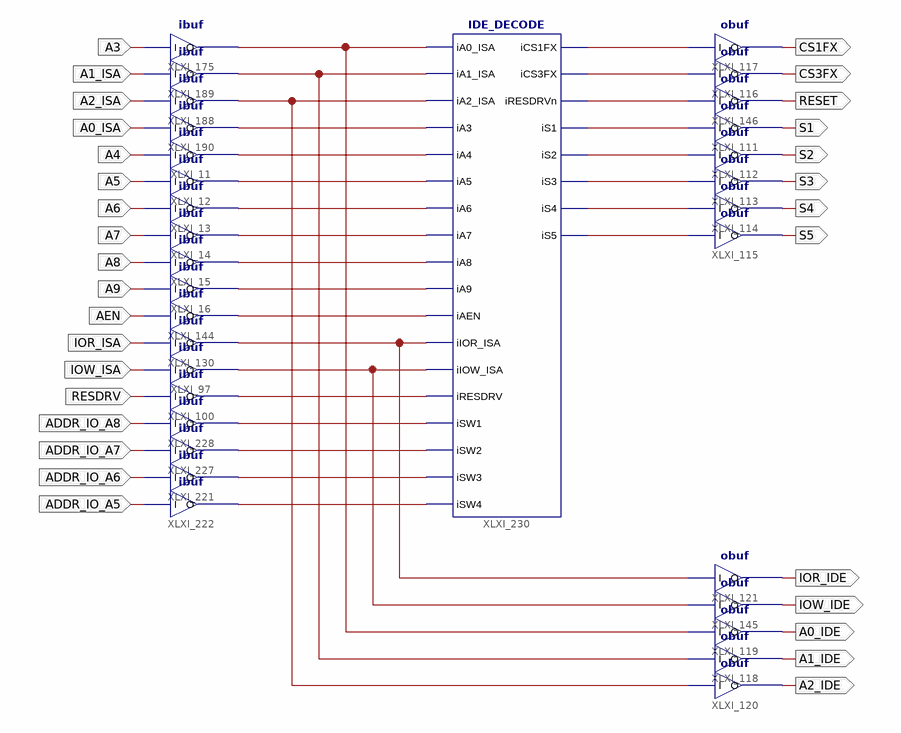
[diagram p0: schematic sheet 1]
// Xilinx ISE schematic Top.sch (xc9500xl) as structural Verilog: 32 symbols, 31 ports
module Top (
  input  RESDRV,
  input  IOW_ISA,
  input  IOR_ISA,
  input  AEN,
  input  A4,
  input  A5,
  input  A6,
  input  A7,
  input  A8,
  input  A9,
  input  A1_ISA,
  input  A2_ISA,
  input  ADDR_IO_A8,
  input  ADDR_IO_A7,
  input  ADDR_IO_A6,
  input  ADDR_IO_A5,
  input  A3,
  input  A0_ISA,
  output A1_IDE,
  output A0_IDE,
  output A2_IDE,
  output IOR_IDE,
  output IOW_IDE,
  output S1,
  output S2,
  output S3,
  output S4,
  output S5,
  output CS3FX,
  output CS1FX,
  output RESET
);

  wire iA0_ISA, iA1_ISA, iA2_ISA, iA3, iA4, iA5, iA6, iA7, iA8, iA9, iAEN, iCS1FX, iCS3FX, iIOR_ISA,
       iIOW_ISA, iRESDRV, iRESDRVn, iS1, iS2, iS3, iS4, iS5, iSW1, iSW2, iSW3, iSW4;

  ibuf XLXI_189 (.I(A1_ISA), .O(iA1_ISA));
  ibuf XLXI_188 (.I(A2_ISA), .O(iA2_ISA));
  ibuf XLXI_11 (.I(A4), .O(iA4));
  ibuf XLXI_144 (.I(AEN), .O(iAEN));
  ibuf XLXI_100 (.I(RESDRV), .O(iRESDRV));
  ibuf XLXI_97 (.I(IOW_ISA), .O(iIOW_ISA));
  ibuf XLXI_130 (.I(IOR_ISA), .O(iIOR_ISA));
  ibuf XLXI_12 (.I(A5), .O(iA5));
  ibuf XLXI_13 (.I(A6), .O(iA6));
  ibuf XLXI_14 (.I(A7), .O(iA7));
  ibuf XLXI_15 (.I(A8), .O(iA8));
  ibuf XLXI_16 (.I(A9), .O(iA9));
  ibuf XLXI_228 (.I(ADDR_IO_A8), .O(iSW1));
  ibuf XLXI_227 (.I(ADDR_IO_A7), .O(iSW2));
  ibuf XLXI_221 (.I(ADDR_IO_A6), .O(iSW3));
  ibuf XLXI_222 (.I(ADDR_IO_A5), .O(iSW4));
  obuf XLXI_120 (.I(iA2_ISA), .O(A2_IDE));
  obuf XLXI_118 (.I(iA1_ISA), .O(A1_IDE));
  obuf XLXI_119 (.I(iA0_ISA), .O(A0_IDE));
  obuf XLXI_145 (.I(iIOW_ISA), .O(IOW_IDE));
  obuf XLXI_121 (.I(iIOR_ISA), .O(IOR_IDE));
  obuf XLXI_115 (.I(iS5), .O(S5));
  obuf XLXI_114 (.I(iS4), .O(S4));
  obuf XLXI_113 (.I(iS3), .O(S3));
  obuf XLXI_112 (.I(iS2), .O(S2));
  obuf XLXI_111 (.I(iS1), .O(S1));
  obuf XLXI_116 (.I(iCS3FX), .O(CS3FX));
  obuf XLXI_117 (.I(iCS1FX), .O(CS1FX));
  obuf XLXI_146 (.I(iRESDRVn), .O(RESET));
  IDE_DECODE XLXI_230 (
    .iA0_ISA(iA0_ISA), .iA1_ISA(iA1_ISA), .iA2_ISA(iA2_ISA), .iA3(iA3), .iA4(iA4), .iA5(iA5), .iA6(iA6),
    .iA7(iA7), .iA8(iA8), .iA9(iA9), .iAEN(iAEN), .iCS1FX(iCS1FX), .iCS3FX(iCS3FX), .iIOR_ISA(iIOR_ISA),
    .iIOW_ISA(iIOW_ISA), .iRESDRV(iRESDRV), .iRESDRVn(iRESDRVn), .iS1(iS1), .iS2(iS2), .iS3(iS3), .iS4(iS4),
    .iS5(iS5), .iSW1(iSW1), .iSW2(iSW2), .iSW3(iSW3), .iSW4(iSW4));
  ibuf XLXI_175 (.I(A3), .O(iA0_ISA));
  ibuf XLXI_190 (.I(A0_ISA), .O(iA3));
endmodule
